# Altium project Gagabiro_supply.PrjPcb
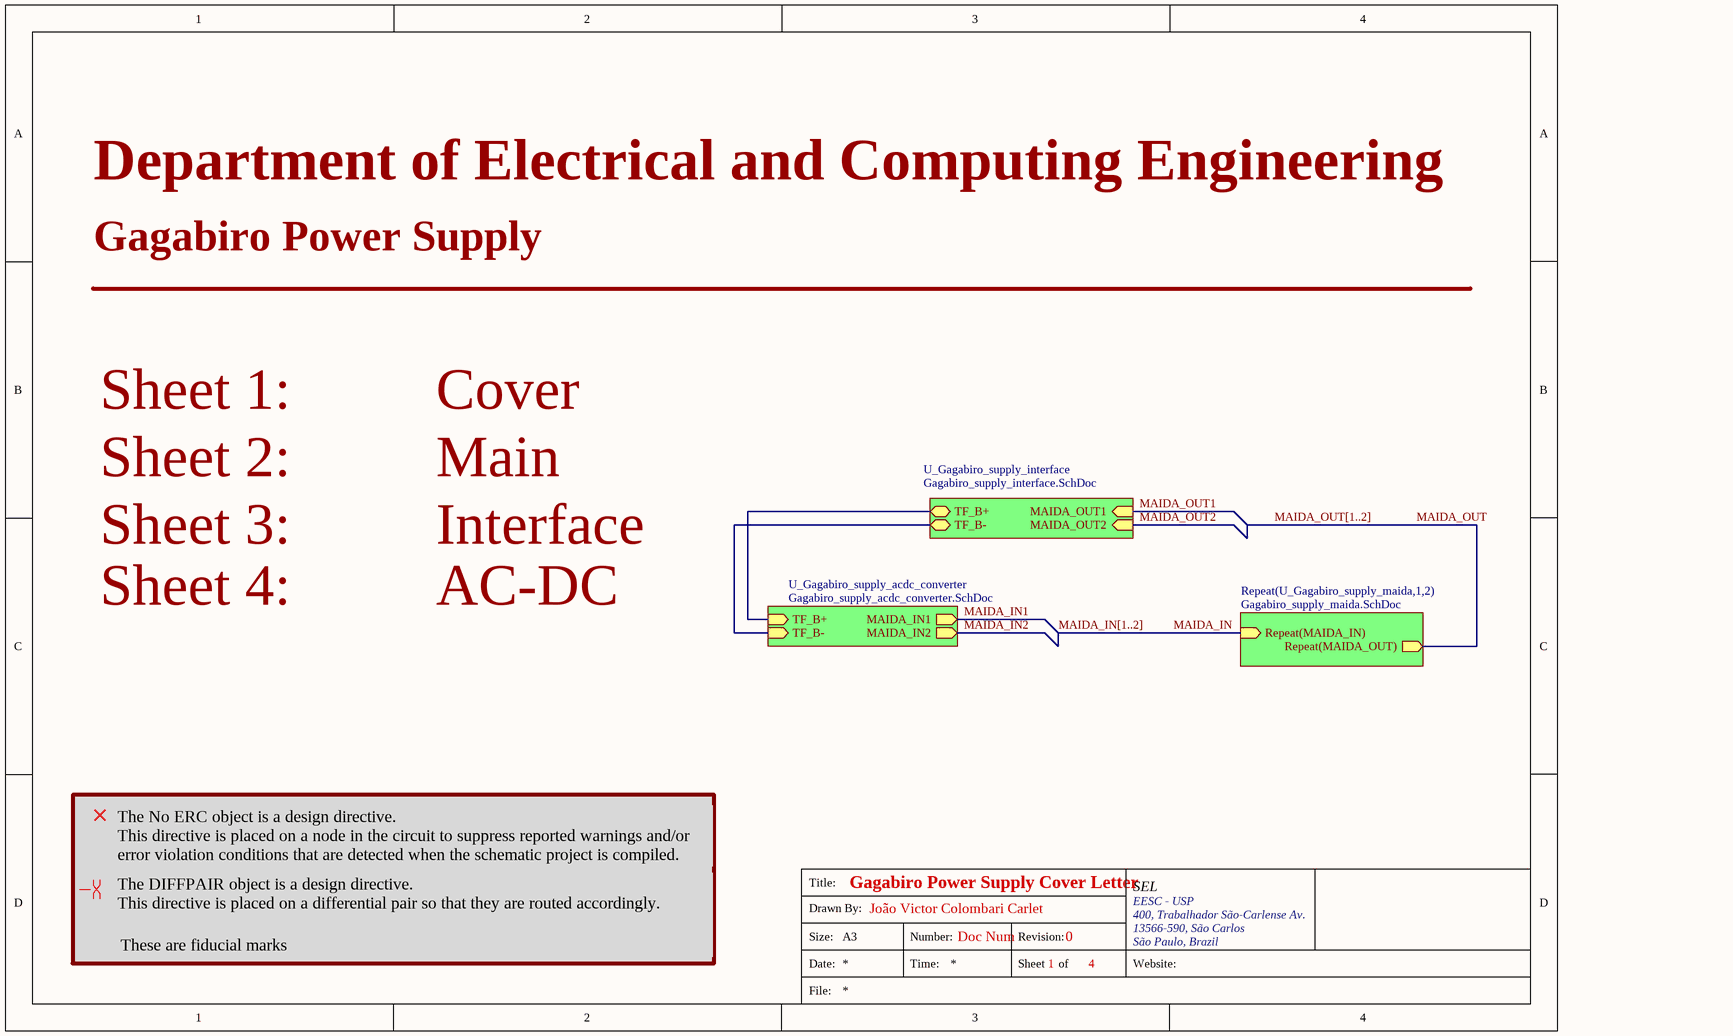
[diagram p0: Gagabiro_supply_cover.SchDoc]
4 sheets, 58 parts. Net scope: hierarchical (ports join the sheet entries above them; power ports are global).
Board file: Gagabiro_supply.PcbDoc
Sheets:
  Gagabiro_supply_cover.SchDoc
    U_Gagabiro_supply_interface = Gagabiro_supply_interface.SchDoc
    U_Gagabiro_supply_maida1 = Gagabiro_supply_maida.SchDoc
    U_Gagabiro_supply_maida2 = Gagabiro_supply_maida.SchDoc
    U_Gagabiro_supply_acdc_converter = Gagabiro_supply_acdc_converter.SchDoc

## Sheet Gagabiro_supply_cover.SchDoc: Gagabiro Power Supply Cover Letter
size 292 x 193 mm; CheckedBy: João Victor Colombari Carlet; Author: João Victor Colombari Carlet; CompanyName: SEL; DrawnBy: João Victor Colombari Carlet; Engineer: João Victor Colombari Carlet; Organization: SEL; Address1: EESC - USP; Address2: 400, Trabalhador São-Carlense Av.; Address3: 13566-590, São Carlos; Address4: São Paulo, Brazil; DocumentNumber: Doc Num; Revision: 0; SheetNumber: 1; SheetTotal: 4

### Sub-sheets
Repeat(U_Gagabiro_supply_maida,1,2) = Gagabiro_supply_maida.SchDoc: Repeat(MAIDA_IN) (in), Repeat(MAIDA_OUT) (out)
U_Gagabiro_supply_acdc_converter = Gagabiro_supply_acdc_converter.SchDoc: TF_B+ (in), TF_B- (in), MAIDA_IN1 (out), MAIDA_IN2 (out)
U_Gagabiro_supply_interface = Gagabiro_supply_interface.SchDoc: TF_B+ (bidir), TF_B- (bidir), MAIDA_OUT1 (in), MAIDA_OUT2 (in)

### Nets
MAIDA_IN: sheet Repeat(U_Gagabiro_supply_maida,1,2)/Repeat(MAIDA_IN)
MAIDA_IN1: sheet U_Gagabiro_supply_acdc_converter/MAIDA_IN1, sheet U_Gagabiro_supply_acdc_converter/MAIDA_IN2  [also labelled MAIDA_IN2]
MAIDA_OUT: sheet Repeat(U_Gagabiro_supply_maida,1,2)/Repeat(MAIDA_OUT)
NetD3_C: sheet U_Gagabiro_supply_interface/TF_B+, sheet U_Gagabiro_supply_acdc_converter/TF_B+
NetD5_C: sheet U_Gagabiro_supply_interface/TF_B-, sheet U_Gagabiro_supply_acdc_converter/TF_B-

### Buses and harness runs
bus MAIDA_IN[1..2]
bus MAIDA_OUT[1..2]

### Layout directives
differential pair: (no net found under the mark)

### Notes on the sheet
- Department of Electrical and Computing Engineering
- Gagabiro Power Supply
- Sheet 1:          Cover
- Sheet 2:          Main
- Sheet 3:          Interface
- Sheet 4:          AC-DC
- The No ERC object is a design directive.
  This directive is placed on a node in the circuit to suppress reported warnings and/or error violation conditions that are detected when the schematic project is compiled.
- The DIFFPAIR object is a design directive.
  This directive is placed on a differential pair so that they are routed accordingly.
- These are fiducial marks
- Title:
- Drawn By:
- Size:
- Date:
- File:
- A3
- Number:
- Time:
- Revision:
- Sheet
- of
- Website:

## Sheet Gagabiro_supply_interface.SchDoc: Gagabiro Power Supply Interface
size 292 x 193 mm; CheckedBy: None; Author: João Victor Colombari Carlet; CompanyName: SEL; DrawnBy: João Victor Colombari Carlet; Engineer: João Victor Colombari Carlet; Organization: SEL; Address1: EESC - USP; Address2: 400, Trabalhador São-Carlense Av.; Address3: 13566-590, São Carlos; Address4: São Paulo, Brazil; SheetNumber: 4; SheetTotal: 4
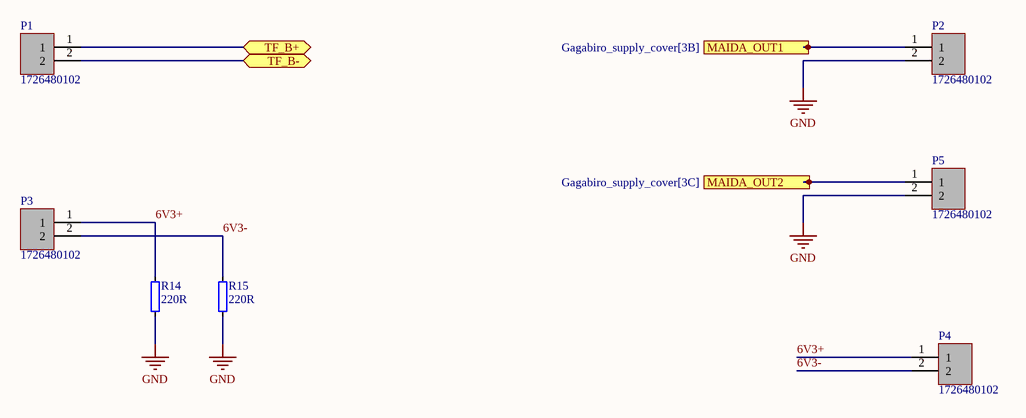
[diagram p1: Gagabiro_supply_interface.SchDoc]

### Parts
P1  1726480102  [MOLEX_1726480102]
P2  1726480102  [MOLEX_1726480102]
P3  1726480102  [MOLEX_1726480102]
P4  1726480102  [MOLEX_1726480102]
P5  1726480102  [MOLEX_1726480102]
R14  220R  [RES_2W_vertical]
R15  220R  [RES_2W_vertical]

### Ports
MAIDA_OUT1 (in, see Gagabiro_supply_cover[3B]), MAIDA_OUT2 (in, see Gagabiro_supply_cover[3C]), TF_B+ (bidir, see Gagabiro_supply_cover[3B], Gagabiro_supply_acdc_converter[2B]), TF_B- (bidir, see Gagabiro_supply_cover[3C], Gagabiro_supply_acdc_converter[2B])

### Nets
GND: P2.2 P5.2 R14.1 R15.1
6V3+: P3.1 P4.1 R14.2
6V3-: P3.2 P4.2 R15.2
MAIDA_OUT1: P2.1 ; port MAIDA_OUT1
MAIDA_OUT2: P5.1 ; port MAIDA_OUT2
NetD3_C: P1.1 ; port TF_B+
NetD5_C: P1.2 ; port TF_B-

### Notes on the sheet
- Title:
- Drawn By:
- Size:
- Date:
- File:
- A3
- Number:
- Time:
- Revision:
- Sheet
- of
- Website:

### Library data of the parts
P1-P5 = 1726480102: Connector Header Surface Mount, Right Angle 2 position 0.079 (2.00mm); MP: S2B-PH-SM4-TB; MF: JST Sales; Price: None; Availability: In Stock; Package: None; Value: *; SnapEDA_Link: https://www.snapeda.com/parts/S2B-PH-SM4-TB/JST+Sales+America+Inc./view-part/?ref=snap; Purchase-URL: https://pricing.snapeda.com/search/part/S2B-PH-SM4-TB/?ref=eda; Check_prices: https://www.snapeda.com/parts/S2B-PH-SM4-TB/JST+Sales+America+Inc./view-part/?ref=eda
R14 R15 = R_2W_vertical_220R: Resistor, 2W; Part Number: R2W; ComponentLink1URL: N.A.; ComponentLink1Description: Datasheet; ComponentLink2URL: N.A.; ComponentLink2Description: Supplier link; Author: colombari; Value: 220R

## Sheet Gagabiro_supply_maida.SchDoc: Gagabiro Power Supply Main
size 292 x 193 mm; ApprovedBy: None; CheckedBy: None; Author: João Victor Colombari Carlet; CompanyName: SEL; DrawnBy: João Victor Colombari Carlet; Engineer: João Victor Colombari Carlet; Organization: SEL; Address1: EESC - USP; Address2: 400, Trabalhador São-Carlense Av.; Address3: 13566-590, São Carlos; Address4: São Paulo, Brazil; DocumentNumber: Doc Num; Revision: 0; SheetNumber: 2; SheetTotal: 4
Used 2 times, as channels U_Gagabiro_supply_maida1, U_Gagabiro_supply_maida2. Parts and nets are listed once, with the designators drawn on the sheet.
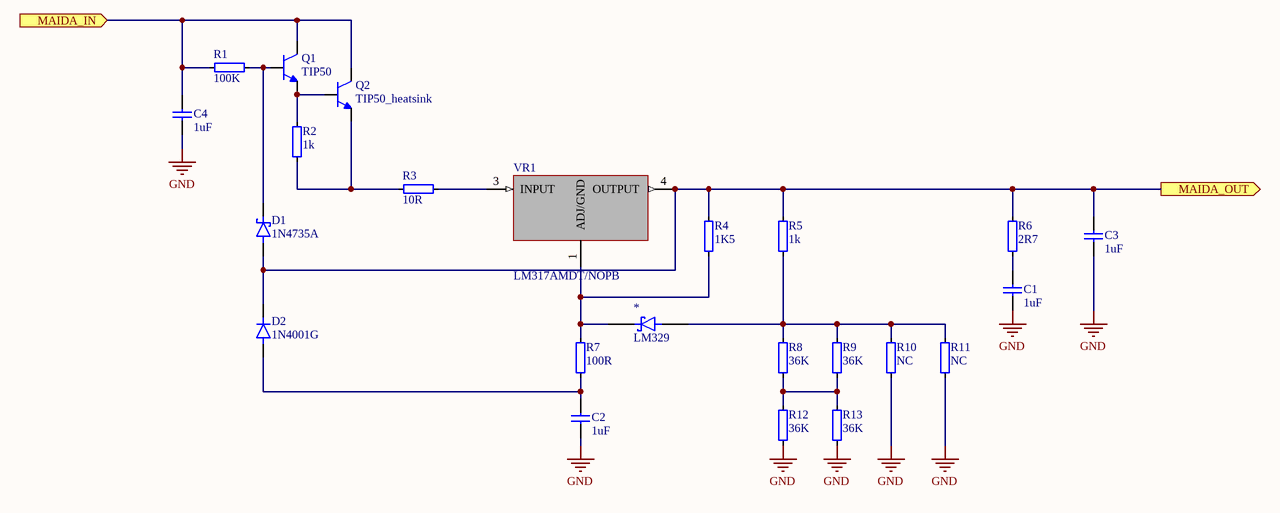
[diagram p2: Gagabiro_supply_maida.SchDoc]

### Parts
*  LM329  [TO92127P495H495-3]
C1  1uF  [CAP_panassonic_1u_450V]
C2  1uF  [CAP_panassonic_1u_450V]
C3  1uF  [CAP_panassonic_1u_450V]
C4  1uF  [CAP_panassonic_1u_450V]
D1  1N4735A  [DIOAD1036W78L463D272]
D2  1N4001G  [DIOAD1036W78L470D235]
Q1  TIP50  [TO254P1009X445X1985-3]
Q2  TIP50_heatsink  [TO254P1009X445X1985-3_heatsink]
R1  100K  [RES_2W_vertical]
R2  1k  [RES_2W_vertical]
R3  10R  [RES_2W_vertical]
R4  1K5  [RES_2W_vertical]
R5  1k  [RES_2W_vertical]
R6  2R7  [RES_2W_vertical]
R7  100R  [RES_2W_vertical]
R8  36K  [RES_2W_vertical]
R9  36K  [RES_2W_vertical]
R10  NC  [RES_2W_vertical]
R11  NC  [RES_2W_vertical]
R12  36K  [RES_2W_vertical]
R13  36K  [RES_2W_vertical]
VR1  LM317AMDT/NOPB  [TO228P991X255-3N]

### Ports
MAIDA_IN (in, see Gagabiro_supply_cover[4C]), MAIDA_OUT (out, see Gagabiro_supply_cover[4C])

### Nets
GND: C1.1 C2.1 C3.1 C4.1 R10.1 R11.1 R12.1 R13.1
MAIDA_IN: C4.2 Q1.2(C) Q2.2(C) R1.1 ; port MAIDA_IN
MAIDA_OUT: C3.2 D1.2(A) D2.C(K) R4.2 R5.2 R6.2 VR1.4(OUTPUT) ; port MAIDA_OUT
Net*_2: *.2 R4.1 R7.2 VR1.1(ADJ/GND)
Net*_3: *.3 R5.1 R8.2 R9.2 R10.2 R11.2
NetC1_2: C1.2 R6.1
NetC2_2: C2.2 D2.A R7.1
NetD1_1: D1.1(K) Q1.1(B) R1.2
NetQ1_3: Q1.3(E) Q2.1(B) R2.2
NetQ2_3: Q2.3(E) R2.1 R3.2
NetR3_1: R3.1 VR1.3(INPUT)
NetR8_1: R8.1 R9.1 R12.2 R13.2

### Channels
U_Gagabiro_supply_maida1: designators end in A; ports MAIDA_IN=MAIDA_IN1 MAIDA_OUT=MAIDA_OUT1
U_Gagabiro_supply_maida2: designators end in B; ports MAIDA_IN=MAIDA_IN1 MAIDA_OUT=MAIDA_OUT2

### Notes on the sheet
- Title:
- Drawn By:
- Size:
- Date:
- File:
- A3
- Number:
- Time:
- Revision:
- Sheet
- of
- Website:

### Library data of the parts
C1-C4 = CAP_POLY_1u: Capacitor, Silver Mica; Part Number: CMICA_47PF; Value: 1uF
D1 = 1N4735A: Zener Diode 6.2V 1W Â±5% Through Hole DO-204AL (DO-41); MF: ON Semiconductor; SnapEDA_Link: https://www.snapeda.com/parts/1N4735A/Onsemi/view-part/?ref=snap; Package: DO-41 ON Semiconductor; Value: *; MP: 1N4735A; Check_prices: https://www.snapeda.com/parts/1N4735A/Onsemi/view-part/?ref=eda
D2 = 1N4001G: 1A, 50V, Standard Recovery Rectifier; MF: Taiwan Semiconductor; Package: DO-41-2 Taiwan Semiconductor; Check_prices: https://www.snapeda.com/parts/1N4001G/Taiwan+Semiconductor/view-part/?ref=eda; Value: *; Price: None; MP: 1N4001G; Purchase-URL: https://pricing.snapeda.com/search/part/1N4001G/?ref=eda; SnapEDA_Link: https://www.snapeda.com/parts/1N4001G/Taiwan+Semiconductor/view-part/?ref=snap; Availability: In Stock
Q1 = TIP50: Bipolar (BJT) Transistor NPN 400 V 1 A 10MHz 2 W Through Hole TO-220-3; MF: ON Semiconductor; Price: None; SnapEDA_Link: https://www.snapeda.com/parts/TIP50/Onsemi/view-part/?ref=snap; Availability: In Stock; Value: *; MP: TIP50; Purchase-URL: https://pricing.snapeda.com/search/part/TIP50/?ref=eda; Package: TO-220-3 onsemi; Check_prices: https://www.snapeda.com/parts/TIP50/Onsemi/view-part/?ref=eda
Q2 = TIP50_heatsink: Bipolar (BJT) Transistor NPN 400 V 1 A 10MHz 2 W Through Hole TO-220-3; MF: ON Semiconductor; MP: TIP50; Price: None; SnapEDA_Link: https://www.snapeda.com/parts/TIP50/Onsemi/view-part/?ref=snap; Availability: In Stock; Value: *; Purchase-URL: https://pricing.snapeda.com/search/part/TIP50/?ref=eda; Package: TO-220-3 onsemi; Check_prices: https://www.snapeda.com/parts/TIP50/Onsemi/view-part/?ref=eda
R1 = R_2W_vertical_100K: Resistor, 2W; Part Number: R2W; ComponentLink1URL: N.A.; ComponentLink1Description: Datasheet; ComponentLink2URL: N.A.; ComponentLink2Description: Supplier link; Author: colombari; Value: 100K
R2 R5 = R_2W_vertical_1k: Resistor, 2W; Part Number: R2W; ComponentLink1URL: N.A.; ComponentLink1Description: Datasheet; ComponentLink2URL: N.A.; ComponentLink2Description: Supplier link; Author: colombari; Value: 1k
R3 = R_2W_vertical_10R: Resistor, 2W; Part Number: R2W; ComponentLink1URL: N.A.; ComponentLink1Description: Datasheet; ComponentLink2URL: N.A.; ComponentLink2Description: Supplier link; Author: colombari; Value: 10R
R4 = R_2W_vertical_1K5: Resistor, 2W; Part Number: R2W; ComponentLink1URL: N.A.; ComponentLink1Description: Datasheet; ComponentLink2URL: N.A.; ComponentLink2Description: Supplier link; Author: colombari; Value: 1K5
R6 = R_2W_vertical_2R7: Resistor, 2W; Part Number: R2W; ComponentLink1URL: N.A.; ComponentLink1Description: Datasheet; ComponentLink2URL: N.A.; ComponentLink2Description: Supplier link; Author: colombari; Value: 2R7
R7 = R_2W_vertical_100R: Resistor, 2W; Part Number: R2W; ComponentLink1URL: N.A.; ComponentLink1Description: Datasheet; ComponentLink2URL: N.A.; ComponentLink2Description: Supplier link; Author: colombari; Value: 100R
R8 R9 R12 R13 = R_2W_vertical_36K: Resistor, 2W; Part Number: R2W; ComponentLink1URL: N.A.; ComponentLink1Description: Datasheet; ComponentLink2URL: N.A.; ComponentLink2Description: Supplier link; Author: colombari; Value: 36K
R10 R11 = R_2W_vertical_NC: Resistor, 2W; Part Number: R2W; ComponentLink1URL: N.A.; ComponentLink1Description: Datasheet; ComponentLink2URL: N.A.; ComponentLink2Description: Supplier link; Author: colombari; Value: NC
VR1 = LM317AMDT/NOPB: Package: None; MP: LM317AMDT/NOPB; Price: None; Availability: Unavailable; Value: *

## Sheet Gagabiro_supply_acdc_converter.SchDoc: Gagabiro Power Supply AC-DC Converter
size 292 x 193 mm; CheckedBy: None; Author: João Victor Colombari Carlet; CompanyName: School of Engineering of São Carlos; DrawnBy: João Victor Colombari Carlet; Engineer: João Victor Colombari Carlet; Organization: SEL; Address1: EESC - USP; Address2: 400, Trabalhador São-Carlense Av.; Address3: 13566-590, São Carlos; Address4: São Paulo, Brazil; Revision: 0; SheetNumber: 3; SheetTotal: 3
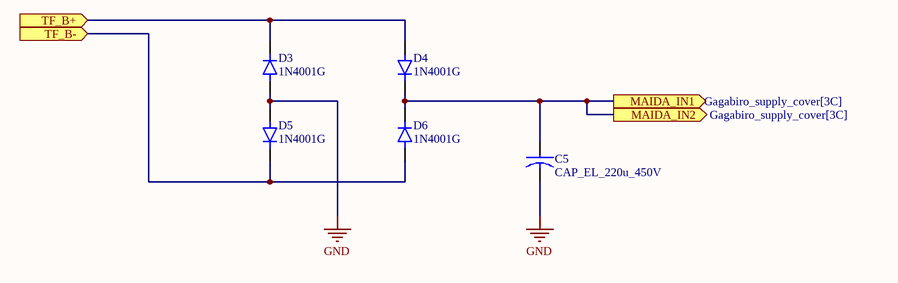
[diagram p3: Gagabiro_supply_acdc_converter.SchDoc]

### Parts
C5  CAP_EL_220u_450V  [CAPPRD500W50D630H1120_stand_25x50]
D3  1N4001G  [DIOAD1036W78L470D235]
D4  1N4001G  [DIOAD1036W78L470D235]
D5  1N4001G  [DIOAD1036W78L470D235]
D6  1N4001G  [DIOAD1036W78L470D235]

### Ports
MAIDA_IN1 (out, see Gagabiro_supply_cover[3C]), MAIDA_IN2 (out, see Gagabiro_supply_cover[3C]), TF_B+ (in, see Gagabiro_supply_cover[2C], Gagabiro_supply_interface[2B]), TF_B- (in, see Gagabiro_supply_cover[2C], Gagabiro_supply_interface[2B])

### Nets
GND: C5.N D3.A D5.A
MAIDA_IN1: C5.P D4.C(K) D6.C(K) ; port MAIDA_IN1, port MAIDA_IN2
NetD3_C: D3.C(K) D4.A ; port TF_B+
NetD5_C: D5.C(K) D6.A ; port TF_B-

### Notes on the sheet
- Title:
- Drawn By:
- Size:
- Date:
- File:
- A3
- Number:
- Time:
- Revision:
- Sheet
- of
- Website:

### Library data of the parts
C5 = CAP_EL_220u_450V: 220F 16V Aluminum Electrolytic Capacitors Radial, Can 1000 Hrs @ 105C; MP: EEU-HD1C221B; Value: 220uF; MF: Panasonic; Availability: In Stock; Purchase-URL: https://pricing.snapeda.com/search/part/EEU-HD1C221B/?ref=eda; Package: RADIAL-2 Panasonic; Check_prices: https://www.snapeda.com/parts/EEU-HD1C221B/Panasonic/view-part/?ref=eda; SnapEDA_Link: https://www.snapeda.com/parts/EEU-HD1C221B/Panasonic/view-part/?ref=snap; Price: None
D3-D6 = 1N4001G: as D2 on sheet Gagabiro_supply_maida; Package: DO-41-2 Taiwan Semiconductor; Check_prices: https://www.snapeda.com/parts/1N4001G/Taiwan+Semiconductor/view-part/?ref=eda; Value: *; Price: None; MP: 1N4001G; Purchase-URL: https://pricing.snapeda.com/search/part/1N4001G/?ref=eda; SnapEDA_Link: https://www.snapeda.com/parts/1N4001G/Taiwan+Semiconductor/view-part/?ref=snap; Availability: In Stock

## Nets that join several sheets
GND: Gagabiro_supply_interface (P2.2 P5.2 R14.1 R15.1), U_Gagabiro_supply_maida1 (8 pins), U_Gagabiro_supply_maida2 (8 pins), Gagabiro_supply_acdc_converter (C5.N D3.A D5.A)
MAIDA_IN1: U_Gagabiro_supply_maida1 (C4A.2 Q1A.2 Q2A.2 R1A.1), U_Gagabiro_supply_maida2 (C4B.2 Q1B.2 Q2B.2 R1B.1), Gagabiro_supply_acdc_converter (C5.P D4.C D6.C)
MAIDA_OUT1: Gagabiro_supply_interface (P2.1), U_Gagabiro_supply_maida1 (7 pins)
MAIDA_OUT2: Gagabiro_supply_interface (P5.1), U_Gagabiro_supply_maida2 (7 pins)
NetD3_C: Gagabiro_supply_interface (P1.1), Gagabiro_supply_acdc_converter (D3.C D4.A)
NetD5_C: Gagabiro_supply_interface (P1.2), Gagabiro_supply_acdc_converter (D5.C D6.A)